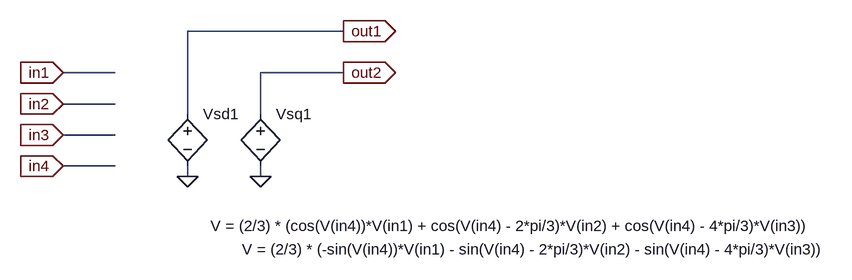
[diagram p0: schematic ABC-DQ.asc]
ABC-DQ.asc, the LTspice schematic file:
Version 4
SHEET 1 1940 680
WIRE 656 0 416 0
WIRE 304 64 224 64
WIRE 656 64 528 64
WIRE 304 112 224 112
WIRE 416 128 416 0
WIRE 528 128 528 64
WIRE 304 160 224 160
WIRE 304 208 224 208
WIRE 416 224 416 208
WIRE 528 224 528 208
FLAG 224 64 in1
IOPIN 224 64 In
FLAG 224 112 in2
IOPIN 224 112 In
FLAG 224 160 in3
IOPIN 224 160 In
FLAG 224 208 in4
IOPIN 224 208 In
FLAG 416 224 0
FLAG 528 224 0
FLAG 656 0 out1
IOPIN 656 0 Out
FLAG 656 64 out2
IOPIN 656 64 Out
SYMBOL bv 416 112 R0
WINDOW 3 35 188 Left 2
SYMATTR Value V = (2/3) * (cos(V(in4))*V(in1) + cos(V(in4) - 2*pi/3)*V(in2) + cos(V(in4) - 4*pi/3)*V(in3))
SYMATTR InstName Vsd1
SYMBOL bv 528 112 R0
WINDOW 3 -28 224 Left 2
SYMATTR Value V = (2/3) * (-sin(V(in4))*V(in1) - sin(V(in4) - 2*pi/3)*V(in2) - sin(V(in4) - 4*pi/3)*V(in3))
SYMATTR InstName Vsq1

The netlist it stands for:
* ABC-DQ.asc
B§Vsd1 out1 0 V = (2/3) * (cos(V(in4))*V(in1) + cos(V(in4) - 2*pi/3)*V(in2) + cos(V(in4) - 4*pi/3)*V(in3))
B§Vsq1 out2 0 V = (2/3) * (-sin(V(in4))*V(in1) - sin(V(in4) - 2*pi/3)*V(in2) - sin(V(in4) - 4*pi/3)*V(in3))
.backanno
.end